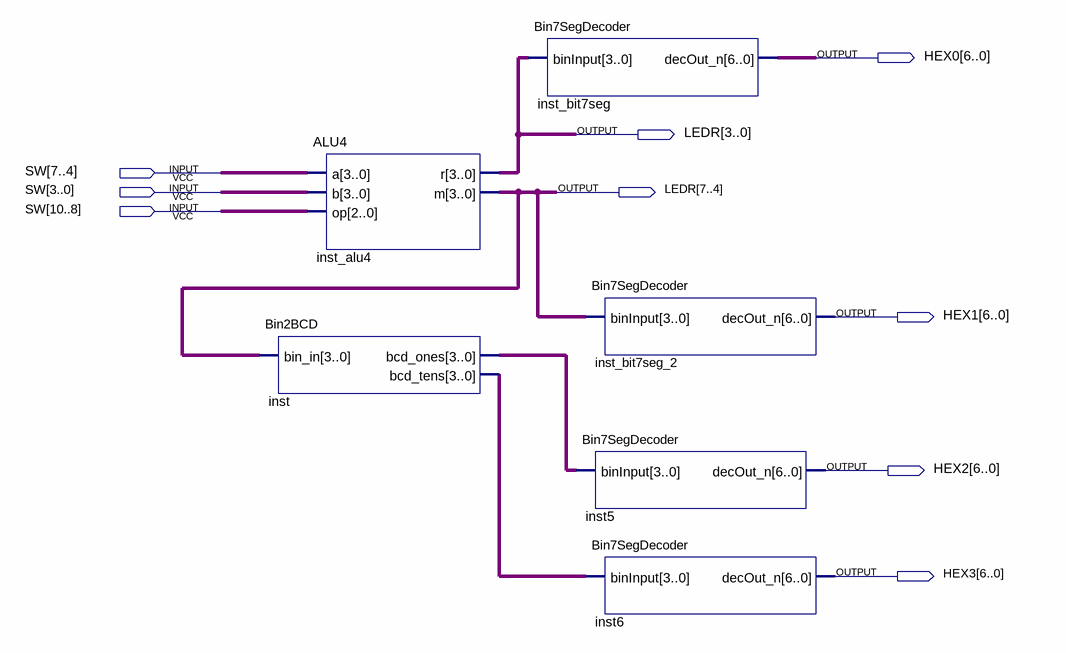
[diagram p0: schematic sheet]
// Quartus schematic ALUDemo.bdf as structural Verilog: 6 symbols, 9 pins
module ALUDemo (
  input  [10:0] SW,
  output [6:0] HEX0,
  output [7:0] LEDR,
  output [6:0] HEX1,
  output [6:0] HEX2,
  output [6:0] HEX3
);

  wire [3:0] inst_bcd_ones, inst_bcd_tens;

  ALU4 inst_alu4 (.a(SW[7:4]), .b(SW[3:0]), .op(SW[10:8]), .r(LEDR[3:0]), .m(LEDR[7:4]));
  Bin2BCD inst (.bin_in(LEDR[7:4]), .bcd_ones(inst_bcd_ones), .bcd_tens(inst_bcd_tens));
  Bin7SegDecoder inst_bit7seg (.binInput(LEDR[3:0]), .decOut_n(HEX0));
  Bin7SegDecoder inst_bit7seg_2 (.binInput(LEDR[7:4]), .decOut_n(HEX1));
  Bin7SegDecoder inst5 (.binInput(inst_bcd_ones), .decOut_n(HEX2));
  Bin7SegDecoder inst6 (.binInput(inst_bcd_tens), .decOut_n(HEX3));
endmodule
